# Altium project DCDC_Top.PrjPcb
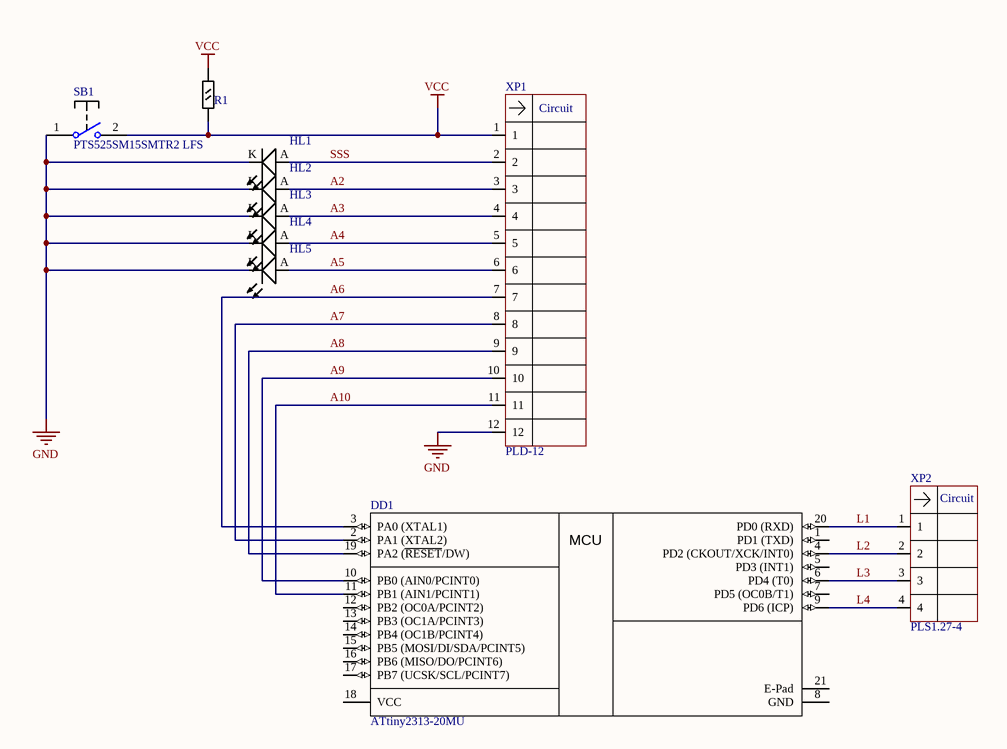
[diagram p0: DCDC_Top.SchDoc]
1 sheet, 10 parts. Net scope: global (net labels, ports and power ports of the same name join across sheets).
Board file: DCDC_Top_2.PcbDoc

## Sheet DCDC_Top.SchDoc
size A4; SheetNumber: 1; SheetTotal: 1

### Parts
DD1  ATtiny2313-20MU  [20M1_M]
HL1  GR-0603  [LED-0603-GREEN]  (value not drawn)
HL2  GR-0603  [LED-0603-GREEN]  (value not drawn)
HL3  GR-0603  [LED-0603-GREEN]  (value not drawn)
HL4  GR-0603  [LED-0603-GREEN]  (value not drawn)
HL5  GR-0603  [LED-0603-GREEN]  (value not drawn)
R1  1k 1%  [1206]  (value not drawn)
SB1  PTS525SM15SMTR2 LFS  [TACT_SWITCH KPT1187B]
XP1  PLD-12  [PLD-12-3D]
XP2  PLS1.27-4  [PLLS1.27-4]

### Nets
GND: HL1.K HL2.K HL3.K HL4.K HL5.K SB1.1(COMMON) XP1.12
VCC: R1.1 R1.2 SB1.2(NO) XP1.1
A2: HL2.A XP1.3
A3: HL3.A XP1.4
A4: HL4.A XP1.5
A5: HL5.A XP1.6
A6: DD1.3(PA0_(XTAL1)) XP1.7
A7: DD1.2(PA1_(XTAL2)) XP1.8
A8: DD1.19(PA2_(~{RESET}/DW)) XP1.9
A9: DD1.10(PB0_(AIN0/PCINT0)) XP1.10
A10: DD1.11(PB1_(AIN1/PCINT1)) XP1.11
L1: DD1.20(PD0_(RXD)) XP2.1
L2: DD1.4(PD2_(CKOUT/XCK/INT0)) XP2.2
L3: DD1.6(PD4_(T0)) XP2.3
L4: DD1.9(PD6_(ICP)) XP2.4
SSS: HL1.A XP1.2

Not connected (* = marked no-connect by the designer): DD1 1(PD1_(TXD)) 5(PD3_(INT1)) 7(PD5_(OC0B/T1)) 8(GND) 12(PB2_(OC0A/PCINT2)) 13(PB3_(OC1A/PCINT3)) 14(PB4_(OC1B/PCINT4)) 15(PB5_(MOSI/DI/SDA/PCINT5)) 16(PB6_(MISO/DO/PCINT6)) 17(PB7_(UCSK/SCL/PCINT7)) 18(VCC) 21(E-Pad)

### Notes on the sheet
- (in symbol ATtiny2313-20MU) MCU
- (in symbol PLD-12) Circuit
- (in symbol PLS1.27-4) Circuit

### Library data of the parts
DD1 = ATtiny2313-20MU: Low Power tinyAVR® 8-Bit Microcontroller, 2K Flash Memory, 20MHz, Industrial Temperature, 20-Lead MLF, Pb-Free; Published: 20-Nov-2009; DatasheetVersion: DOC2543B, Mar-2009; PackageVersion: revA, Oct-2004; PackageReference: 20M1; Publisher: Altium Limited; PackageDescription: 20-pad, 4 x 4 x 0.8 mm Body, Lead Pitch 0.50 mm, 2.6 mm Exposed Pad, Micro Lead Frame Package (MLF); Supplier 1: Digi-Key; Supplier Part Number 1: ATTINY2313-20MU-ND; Supplier 2: Farnell; Supplier Part Number 2: 1748539; Supplier 3: Mouser; Supplier Part Number 3: 556-ATTINY2313-20MU; Code_JEDEC: MO-220WGGD-5; ComponentLink1Description: Manufacturer Link; ComponentLink1URL: http://www.atmel.com/products/AVR/tinyavr.asp?; ComponentLink2Description: Datasheet; ComponentLink2URL: http://www.atmel.com/dyn/resources/prod_documents/doc2543.pdf; ComponentLink3Description: Atmel.com Home; ComponentLink3URL: http://www.atmel.com; Part Number: ATtiny2313-20MU
HL1-HL5 = 150060VS55040: LED GREEN DIFFUSED 0603 SMD; Part Number: 150060VS55040; HelpURL: https://www.mouser.com/ProductDetail/Wurth-Elektronik/150060VS55040?qs=%2Fha2pyFaduhwKZlJ%252BauMPGbe2qb%2FJX%2FXBiS9WUTr3iltzze5OTUvag%3D%3D; Digi-Key Part Number: 732-12017-1-ND; Price$: 0.115; Manufacturer Part Number: 150060VS55040; Package: 0603; Mouser Part Number: 710-150060VS55040
R1 = AA1206FR-071KL: RES SMD 1K ohm 1% 200V AEC-Q200; Part Number: AA1206FR-071KL; HelpURL: https://eu.mouser.com/ProductDetail/Yageo/AA1206FR-071KL?qs=sGAEpiMZZMtlubZbdhIBIKyAF7UHeJ2Z5UA335zQE8A%3D; Price$: 0.036; Manufacturer Part Number: AA1206FR-071KL; Package: 1206; Mouser Part Number: 603-AA1206FR-071KL
SB1 = PTS525SM15SMTR2 LFS: SWITCH TACTILE SPST-NO 0.02A 15V; Part Number: PTS525SM15SMTR2 LFS; HelpURL: https://www.digikey.com/products/en?keywords=CKN9104CT-ND; Digi-Key Part Number: CKN9104CT-ND; Price$: 0.33; Manufacturer Part Number: PTS525SM15SMTR2 LFS
XP1 = PLD-12: System: Connector; Part Number: PLD-12
XP2 = PLS1.27-4: System: Connector; Part Number: PLS1.27-4